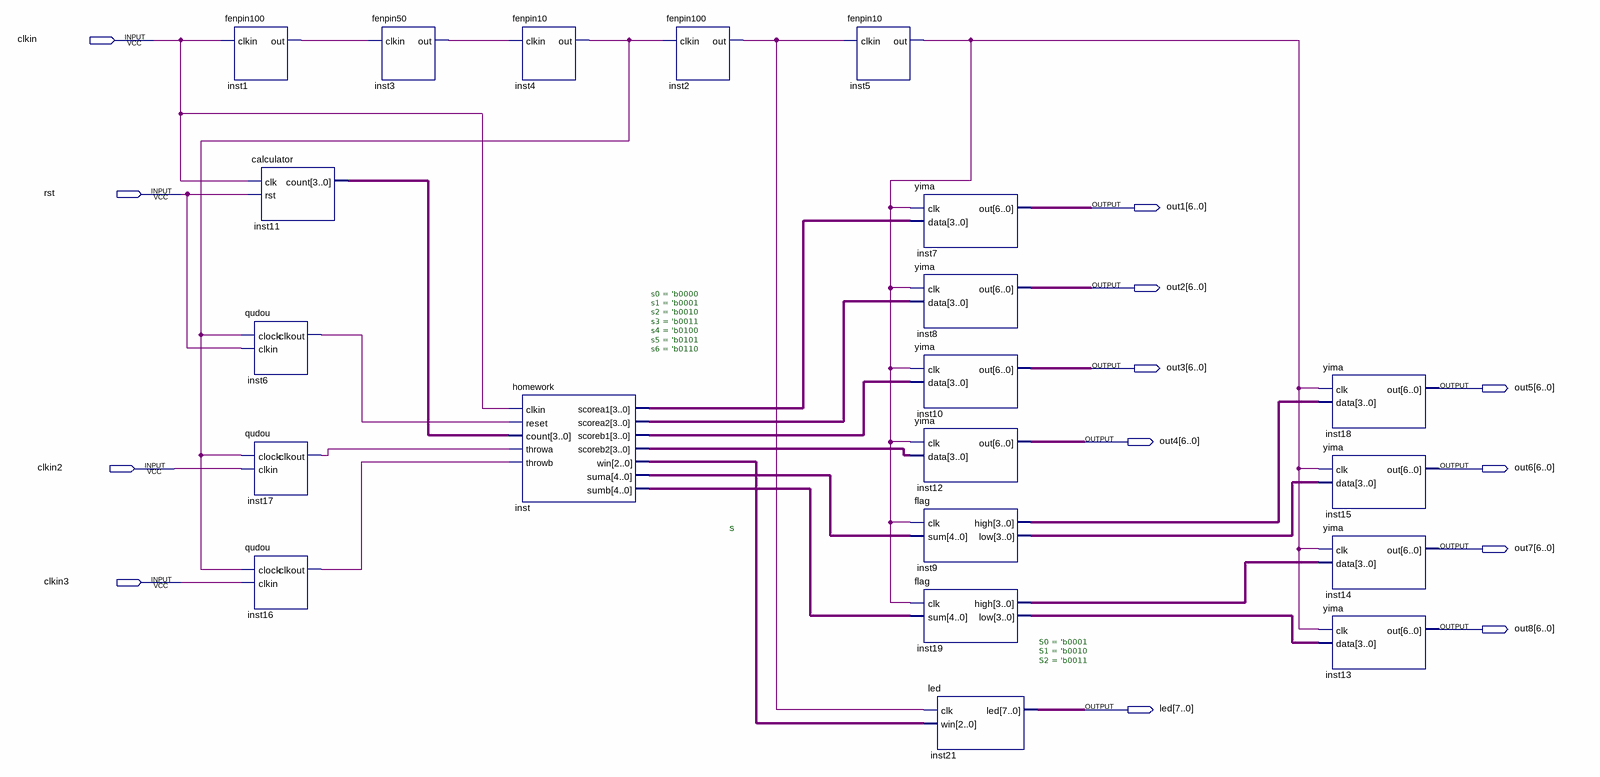
[diagram p0: schematic sheet]
// Quartus schematic Block1.bdf as structural Verilog: 21 symbols, 13 pins
module Block1 (
  input  clkin,
  input  rst,
  input  clkin2,
  input  clkin3,
  output [6:0] out1,
  output [6:0] out2,
  output [6:0] out3,
  output [6:0] out5,
  output [6:0] out4,
  output [6:0] out6,
  output [6:0] out7,
  output [6:0] out8,
  output [7:0] led
);

  wire inst1_out, inst2_out, inst3_out, inst4_out, inst5_out, inst6_clkout, inst16_clkout, inst17_clkout;
  wire [2:0] inst_win;
  wire [3:0] inst9_high, inst9_low, inst11_count, inst19_high, inst19_low, inst_scorea1, inst_scorea2,
       inst_scoreb1, inst_scoreb2;
  wire [4:0] inst_suma, inst_sumb;

  fenpin100 inst1 (.clkin(clkin), .out(inst1_out));
  calculator inst11 (.clk(clkin), .rst(rst), .count(inst11_count));
  qudou inst6 (.clock(inst4_out), .clkin(rst), .clkout(inst6_clkout));
  qudou inst17 (.clock(inst4_out), .clkin(clkin2), .clkout(inst17_clkout));
  qudou inst16 (.clock(inst4_out), .clkin(clkin3), .clkout(inst16_clkout));
  fenpin50 inst3 (.clkin(inst1_out), .out(inst3_out));
  fenpin10 inst4 (.clkin(inst3_out), .out(inst4_out));
  homework #(.s0('b0000), .s1('b0001), .s2('b0010), .s3('b0011), .s4('b0100), .s5('b0101), .s6('b0110)) inst (
    .clkin(clkin), .reset(inst6_clkout), .count(inst11_count), .throwa(inst17_clkout),
    .throwb(inst16_clkout), .scorea1(inst_scorea1), .scorea2(inst_scorea2), .scoreb1(inst_scoreb1),
    .scoreb2(inst_scoreb2), .win(inst_win), .suma(inst_suma), .sumb(inst_sumb));
  fenpin100 inst2 (.clkin(inst4_out), .out(inst2_out));
  fenpin10 inst5 (.clkin(inst2_out), .out(inst5_out));
  yima inst7 (.clk(inst5_out), .data(inst_scorea1), .out(out1));
  yima inst8 (.clk(inst5_out), .data(inst_scorea2), .out(out2));
  yima inst10 (.clk(inst5_out), .data(inst_scoreb1), .out(out3));
  yima inst12 (.clk(inst5_out), .data(inst_scoreb2), .out(out4));
  flag inst9 (.clk(inst5_out), .sum(inst_suma), .high(inst9_high), .low(inst9_low));
  flag inst19 (.clk(inst5_out), .sum(inst_sumb), .high(inst19_high), .low(inst19_low));
  led #(.S0('b0001), .S1('b0010), .S2('b0011)) inst21 (.clk(inst2_out), .win(inst_win), .led(led));
  yima inst18 (.clk(inst5_out), .data(inst9_high), .out(out5));
  yima inst15 (.clk(inst5_out), .data(inst9_low), .out(out6));
  yima inst14 (.clk(inst5_out), .data(inst19_high), .out(out7));
  yima inst13 (.clk(inst5_out), .data(inst19_low), .out(out8));

  // Notes on the sheet:
  //   s
endmodule
